# Altium schematic sheet comparator.SchDoc
size A4
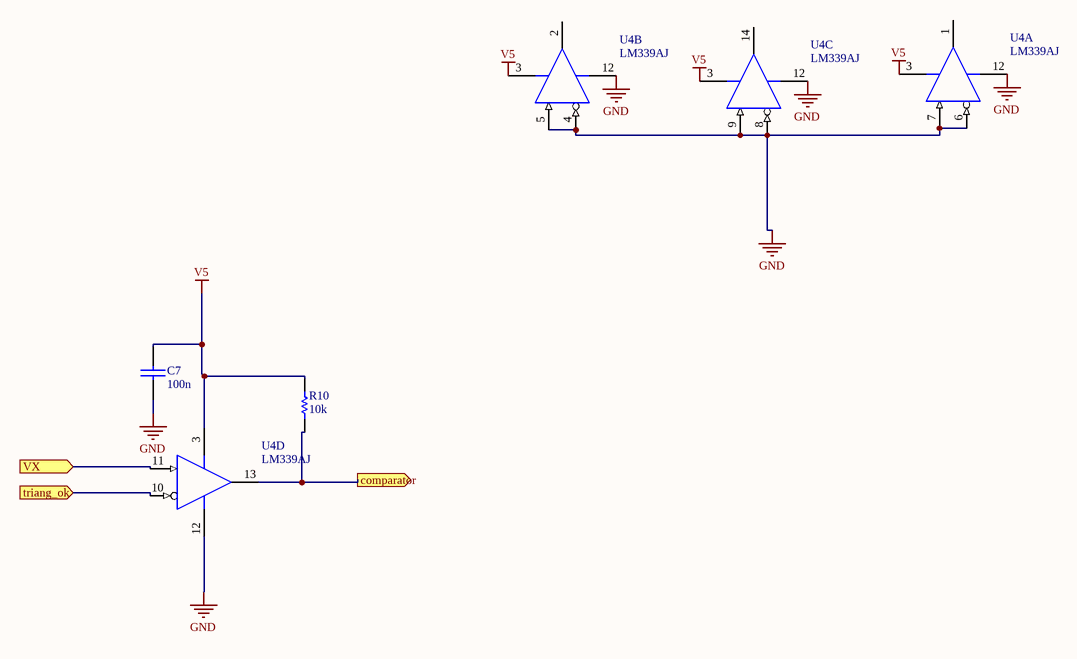
[diagram p0: comparator.SchDoc]

## Parts
C7  100n  [CAP200]
R10  10k  [RES400]
U4  LM339AJ  [J014]  (parts A,B,C,D of 4)

## Ports
comparator (out), triang_ok (in), VX (in)

## Nets
GND: C7.2 U4.4(IN-) U4.5(IN+) U4.6(IN-) U4.7(IN+) U4.8(IN-) U4.9(IN+) U4.12(GND)
V5: C7.1 R10.2 U4.3(VCC)
comparator: R10.1 U4.13(OUT) ; port comparator
triang_ok: U4.10(IN-) ; port triang_ok
VX: U4.11(IN+) ; port VX

Not connected (* = marked no-connect by the designer): U4 1(OUT) 2(OUT) 14(OUT)

## Library data of the parts
C7 = CAP
R10 = RES
U4 = LM339AJ: Quad Differential Comparator; Published: 15-Apr-2002; LatestRevisionDate: 04-Mar-2005; LatestRevisionNote: Stylized 3D Model Added.; DatasheetVersion: Apr-1988; PackageVersion: Jun-1999; PackageReference: J014; Publisher: Altium Limited; PackageDescription: DIP; 14 Leads; Row Spacing 7.62 mm; Pitch 2.54 mm; ComponentLink1Description: Manufacturer Link; ComponentLink1URL: http://www.ti.com/; ComponentLink2Description: Datasheet; ComponentLink2URL: http://www-s.ti.com/sc/ds/lm139a.pdf